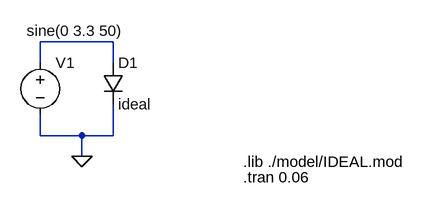
[diagram p0: schematic half_wave_rectifier.asc]
half_wave_rectifier.asc, the LTspice schematic file:
Version 4
SHEET 1 880 680
WIRE 400 240 288 240
WIRE 288 272 288 240
WIRE 400 272 400 240
WIRE 288 384 288 352
WIRE 352 384 288 384
WIRE 400 384 400 336
WIRE 400 384 352 384
WIRE 352 416 352 384
FLAG 352 416 0
SYMBOL diode 384 272 R0
SYMATTR InstName D1
SYMATTR Value ideal
SYMBOL voltage 288 256 R0
WINDOW 3 -21 -33 Left 2
SYMATTR InstName V1
SYMATTR Value sine(0 3.3 50)
TEXT 600 424 Left 2 !.lib ./model/IDEAL.mod
TEXT 600 448 Left 2 !.tran 0.06

The netlist it stands for:
* half_wave_rectifier.asc
D1 N001 0 ideal
V1 N001 0 sine(0 3.3 50)
.model D D
.lib standard.dio
.lib ./model/IDEAL.mod
.tran 0.06
.backanno
.end